# EAGLE design 1.0 (EAGLE 9.2.0)
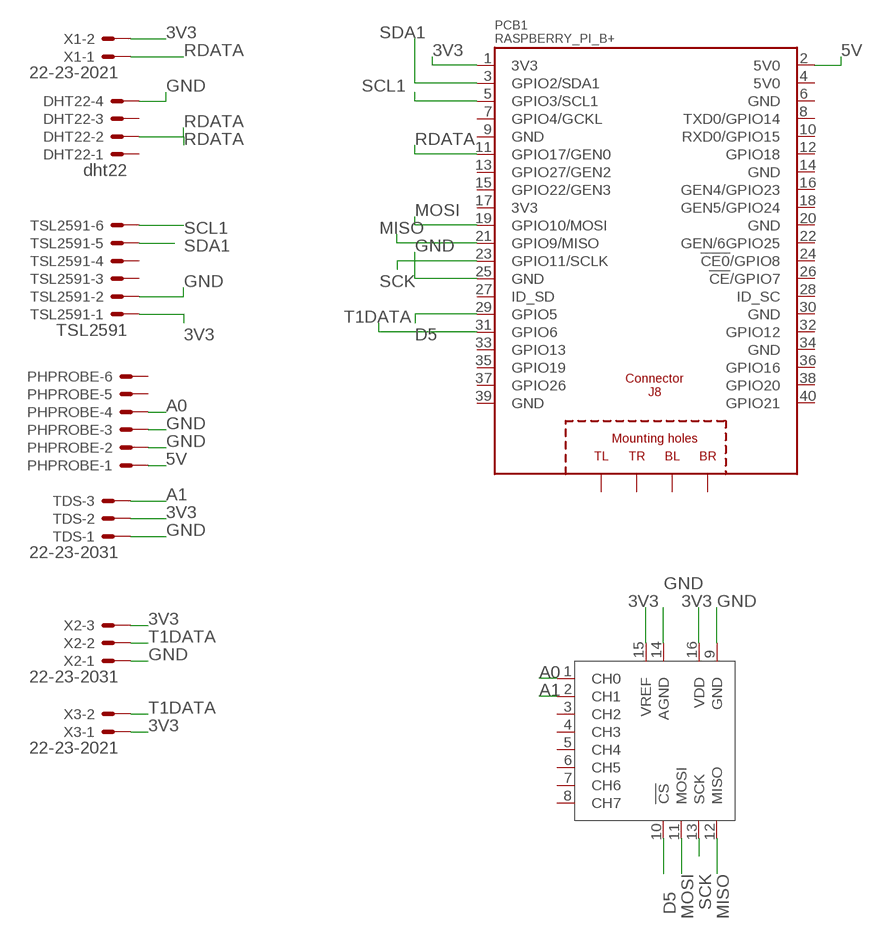
[diagram p0: schematic, sheet 1]

## Parts
DHT22  dht22  22-23-2041  [22-23-2041]
PCB1  RASPBERRY_PI_B+  [RASPBERRY_PI_B+]
PHPROBE  22-23-2061  [22-23-2061]
TDS  22-23-2031  [22-23-2031]
TSL2591  TSL2591  22-23-2061  [22-23-2061]
U$1  MCP3008P  [DIL16]
X1  22-23-2021  [22-23-2021]
X2  22-23-2031  [22-23-2031]
X3  22-23-2021  [22-23-2021]

## Nets
3V3: PCB1.1(3V3) TDS.2 TSL2591.1 U$1.15(VREF) U$1.16(VDD) X1.2 X2.3 X3.1
5V: PCB1.2(5V0) PHPROBE.1
A0: PHPROBE.4 U$1.1(CH0)
A1: TDS.3 U$1.2(CH1)
D5: PCB1.29(GPIO5) U$1.10(!CS)
GND: DHT22.4 PCB1.25(GND) PHPROBE.2 PHPROBE.3 TDS.1 TSL2591.2 U$1.9(GND) U$1.14(AGND) X2.1
MISO: PCB1.21(GPIO9/MISO) U$1.12(MISO)
MOSI: PCB1.19(GPIO10/MOSI) U$1.11(MOSI)
RDATA: DHT22.2 PCB1.11(GPIO17/GEN0) X1.1
SCK: PCB1.23(GPIO11/SCLK) U$1.13(SCK)
SCL1: PCB1.5(GPIO3/SCL1) TSL2591.6
SDA1: PCB1.3(GPIO2/SDA1) TSL2591.5
T1DATA: PCB1.31(GPIO6) X2.2 X3.2
Unconnected: DHT22.1 DHT22.3 PCB1.4(5V0) PCB1.6(GND) PCB1.7(GPIO4/GCKL) PCB1.8(TXD0/GPIO14) PCB1.9(GND) PCB1.10(RXD0/GPIO15) PCB1.12(GPIO18) PCB1.13(GPIO27/GEN2) PCB1.14(GND) PCB1.15(GPIO22/GEN3) PCB1.16(GEN4/GPIO23) PCB1.17(3V3) PCB1.18(GEN5/GPIO24) PCB1.20(GND) PCB1.22(GEN/6GPIO25) PCB1.24(!CE0!/GPIO8) PCB1.26(!CE!/GPIO7) PCB1.27(ID_SD) PCB1.28(ID_SC) PCB1.30(GND) PCB1.32(GPIO12) PCB1.33(GPIO13) PCB1.34(GND) PCB1.35(GPIO19) PCB1.36(GPIO16) PCB1.37(GPIO26) PCB1.38(GPIO20) PCB1.39(GND) PCB1.40(GPIO21) PCB1.PE_BL(BL) PCB1.PE_BR(BR) PCB1.PE_TL(TL) PCB1.PE_TR(TR) PHPROBE.5 PHPROBE.6 TSL2591.3 TSL2591.4 U$1.3(CH2) U$1.4(CH3) U$1.5(CH4) U$1.6(CH5) U$1.7(CH6) U$1.8(CH7)

## Library data of the parts
DHT22 = con-molex:22-23-2041: .100" (2.54mm) Center Header - 4 Pin; MF: MOLEX; MPN: 22-23-2041; OC_FARNELL: 1462920; OC_NEWARK: 38C0355
PCB1 = RASPBERRY_PI_Bplus:RASPBERRY_PI_B+: Raspberry Pi B+ Based on issue: Thursday, July 10, 2014 - Rev 1.2 LBR by Tim R. 07-2014
PHPROBE TSL2591 = con-molex:22-23-2061: .100" (2.54mm) Center Header - 6 Pin; MF: MOLEX; MPN: 22-23-2061; OC_FARNELL: 1462922; OC_NEWARK: 27C1933
TDS X2 = con-molex:22-23-2031: .100" (2.54mm) Center Header - 3 Pin; MF: MOLEX; MPN: 22-23-2031; OC_FARNELL: 1462950; OC_NEWARK: 30C0862
U$1 = MCP3008:MCP3008
X1 X3 = con-molex:22-23-2021: .100" (2.54mm) Center Header - 2 Pin; MF: MOLEX; MPN: 22-23-2021; OC_FARNELL: 1462926; OC_NEWARK: 25C3832

## Board
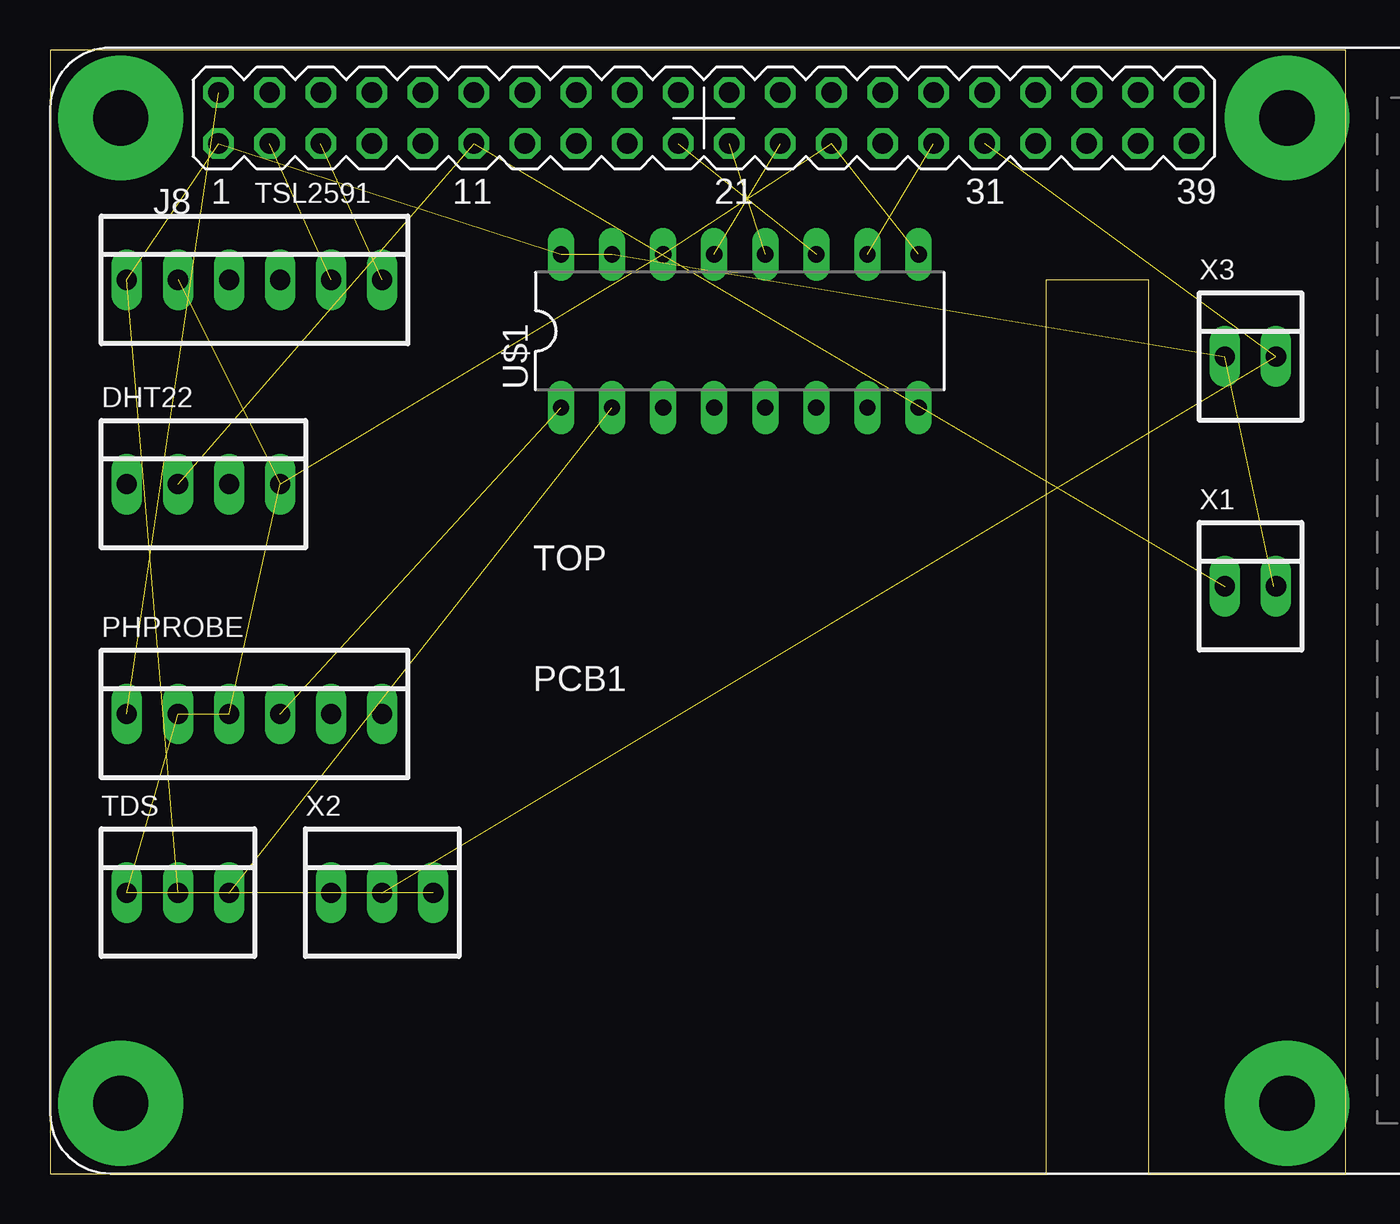
[diagram p1: board, top side]
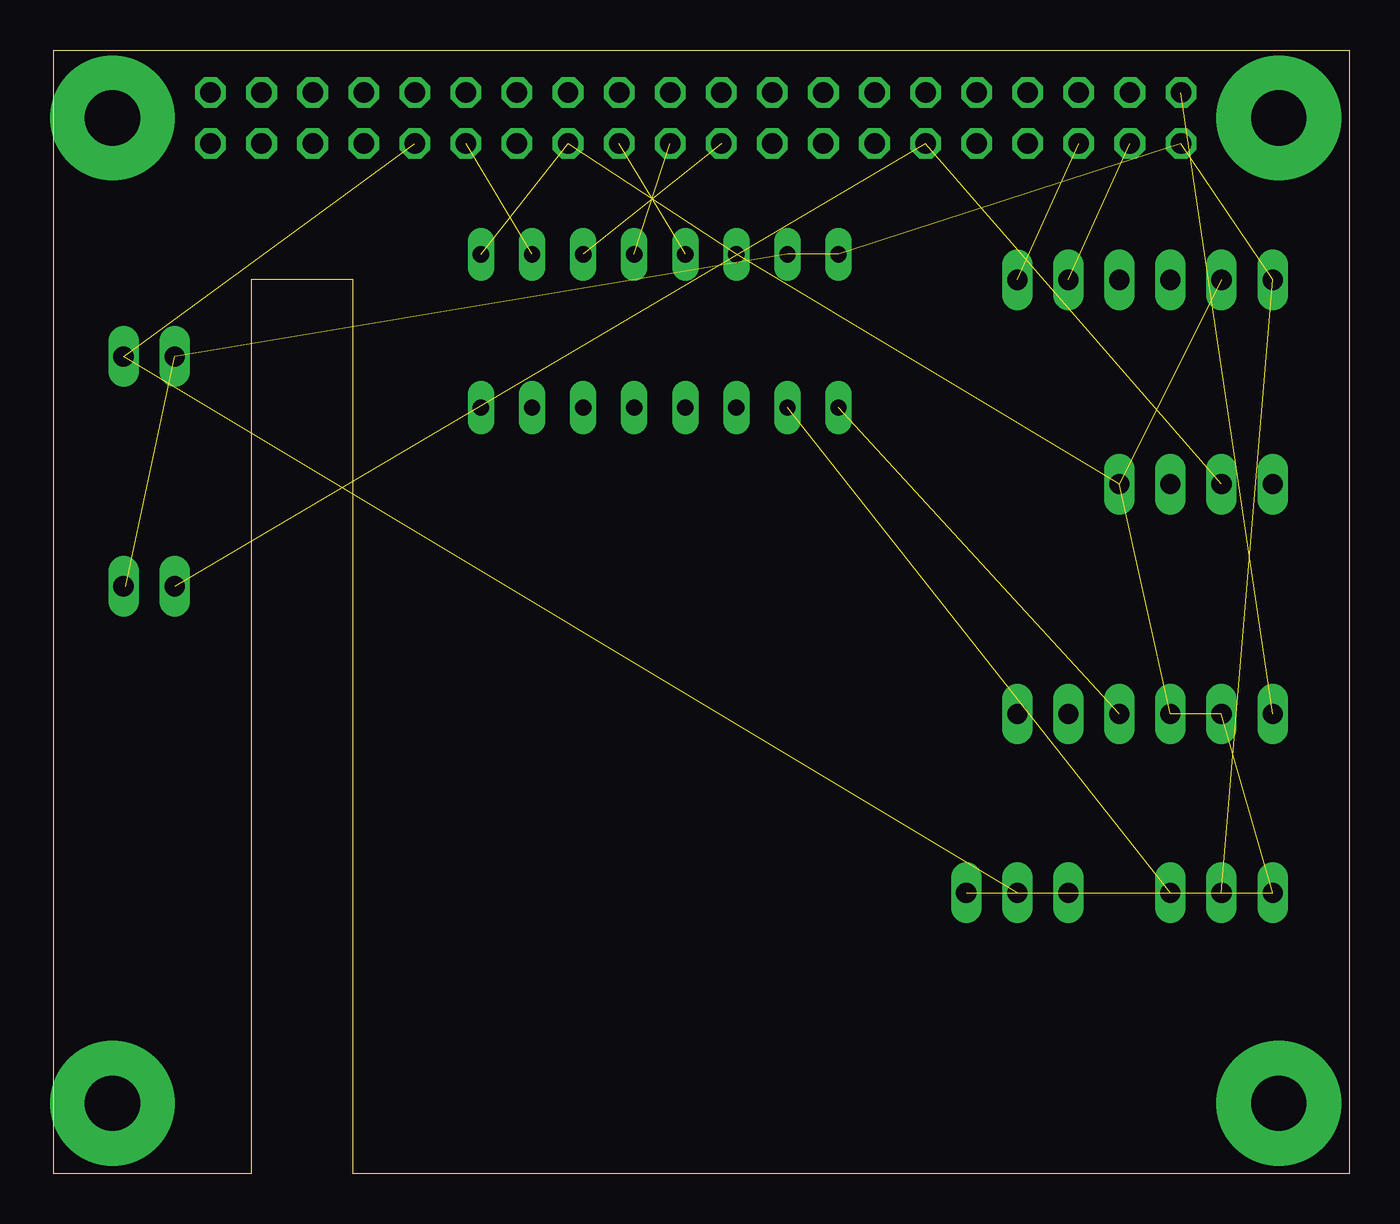
[diagram p2: board, bottom side, seen from below]

Size 64.44 x 55.87 mm. Coordinates in mm from the lower left corner, seen from the top.
Outline: 0,0 49.53,0 49.53,44.45 54.61,44.45 54.61,0 64.44,0 64.44,55.87 0,55.87 0,0
Copper layers (1*16): Top 0.035mm / dielectric 1.5mm / Bottom 0.035mm
Design rules "default": minimum track width 6mil, minimum drill 0.35mm, track to track 6mil, track to pad 6mil, pad to pad 6mil, via to via 6mil, smd to smd 6mil, copper to edge 40mil, drill to drill 6mil, minimum pad ring 10mil, minimum via ring 8mil, stop-mask expansion 4mil, vias tented up to drill 0mil, thermal gap 10mil

### Footprints (pad centres in the part's own frame; a part is rotated, then mirrored left to right if it is on the bottom)
22-23-2041 = drill 1 long: 1 -3.81,0; 2 -1.27,0; 3 1.27,0; 4 3.81,0
RASPBERRY_PI_B+ = drill 1.016 octagon: 1 8.37,51.23; 2 8.37,53.77; 3 10.91,51.23; 4 10.91,53.77; 5 13.45,51.23; 6 13.45,53.77; 7 15.99,51.23; 8 15.99,53.77; 9 18.53,51.23; 10 18.53,53.77; 11 21.07,51.23; 12 21.07,53.77; 13 23.61,51.23; 14 23.61,53.77; 15 26.15,51.23; 16 26.15,53.77; 17 28.69,51.23; 18 28.69,53.77; 19 31.23,51.23; 20 31.23,53.77; 21 33.77,51.23; 22 33.77,53.77; 23 36.31,51.23; 24 36.31,53.77; 25 38.85,51.23; 26 38.85,53.77; 27 41.39,51.23; 28 41.39,53.77; 29 43.93,51.23; 30 43.93,53.77; 31 46.47,51.23; 32 46.47,53.77; 33 49.01,51.23; 34 49.01,53.77; 35 51.55,51.23; 36 51.55,53.77; 37 54.09,51.23; 38 54.09,53.77; 39 56.63,51.23; 40 56.63,53.77 | drill 2.75 pad 6.2: PE_BL 3.5,3.5; PE_BR 61.5,3.5; PE_TL 3.5,52.5; PE_TR 61.5,52.5
22-23-2061 = drill 1 long: 1 -6.35,0; 2 -3.81,0; 3 -1.27,0; 4 1.27,0; 5 3.81,0; 6 6.35,0
22-23-2031 = drill 1 long: 1 -2.54,0; 2 0,0; 3 2.54,0
DIL16 = drill 0.813 long: 1 -8.89,-3.81; 2 -6.35,-3.81; 3 -3.81,-3.81; 4 -1.27,-3.81; 5 1.27,-3.81; 6 3.81,-3.81; 7 6.35,-3.81; 8 8.89,-3.81; 9 8.89,3.81; 10 6.35,3.81; 11 3.81,3.81; 12 1.27,3.81; 13 -1.27,3.81; 14 -3.81,3.81; 15 -6.35,3.81; 16 -8.89,3.81
22-23-2021 = drill 1 long: 1 -1.27,0; 2 1.27,0

### Placement (x,y rotation side)
DHT22  7.62,34.29 0 top
PCB1  0,0 0 top
PHPROBE  10.16,22.86 0 top
TDS  6.35,13.97 0 top
TSL2591  10.16,44.45 0 top
U$1  34.29,41.91 0 top
X1  59.69,29.21 0 top
X2  16.51,13.97 0 top
X3  59.69,40.64 0 top

### Tracks (layer width: path | path; a pad name or v marks a point on that pad's centre or on a via)
3V3  (7 unrouted)
  Bottom 0.152: X1.2 60.86,29.21
5V  (1 unrouted)
A0  (1 unrouted)
A1  (1 unrouted)
D5  (1 unrouted)
GND  (8 unrouted)
MISO  (1 unrouted)
MOSI  (1 unrouted)
RDATA  (2 unrouted)
SCK  (1 unrouted)
SCL1  (1 unrouted)
SDA1  (1 unrouted)
T1DATA  (2 unrouted)